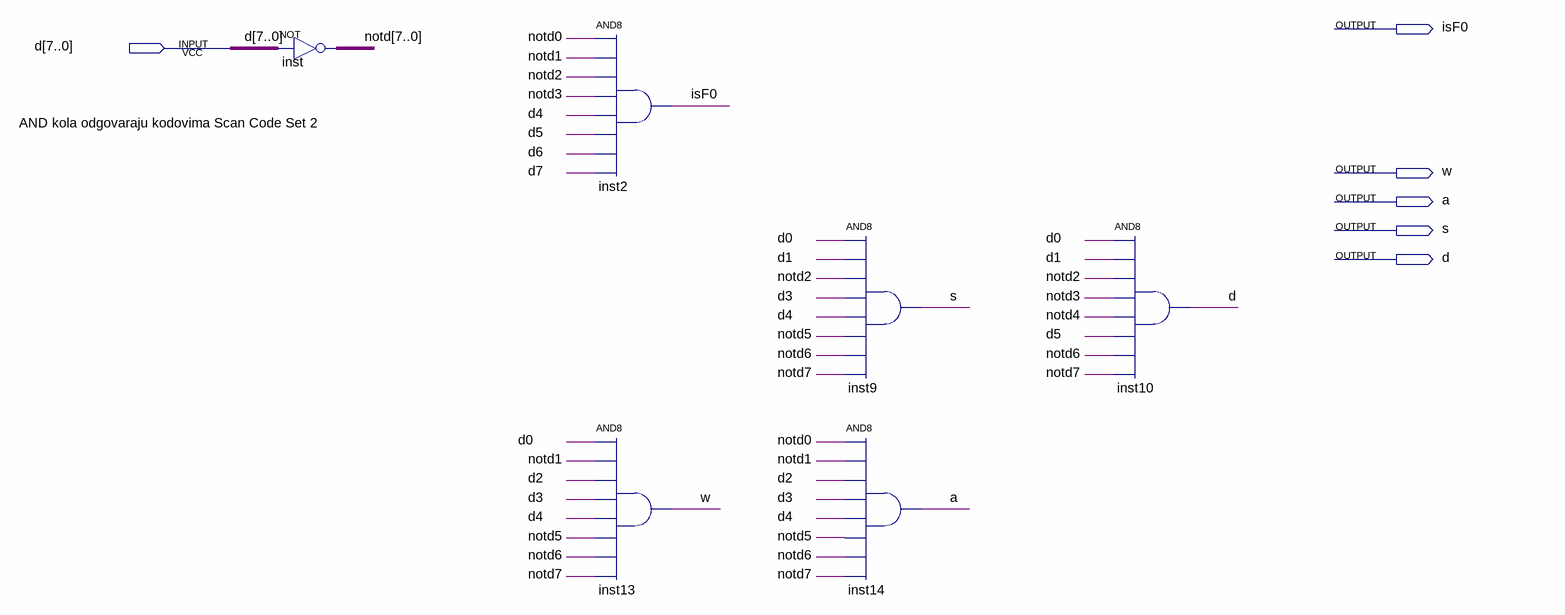
[diagram p0: schematic sheet]
// Quartus schematic KeyDetector.bdf as structural Verilog: 6 symbols, 6 pins
module KeyDetector (
  input  [7:0] d,
  output isF0,
  output w,
  output a,
  output s,
  output d_1bit
);

  wire [7:0] notd;

  assign notd = ~d;  // NOT inst, 8 bits wide
  and inst2 (isF0, notd[0], notd[1], notd[2], notd[3], d[4], d[5], d[6], d[7]);
  and inst13 (w, d[0], notd[1], d[2], d[3], d[4], notd[5], notd[6], notd[7]);
  and inst9 (s, d[0], d[1], notd[2], d[3], d[4], notd[5], notd[6], notd[7]);
  and inst14 (a, notd[0], notd[1], d[2], d[3], d[4], notd[5], notd[6], notd[7]);
  and inst10 (d_1bit, d[0], d[1], notd[2], notd[3], notd[4], d[5], notd[6], notd[7]);

  // Notes on the sheet:
  //   AND kola odgovaraju kodovima Scan Code Set 2
endmodule
